# Altium schematic sheet MPU6050.SchDoc
size A4
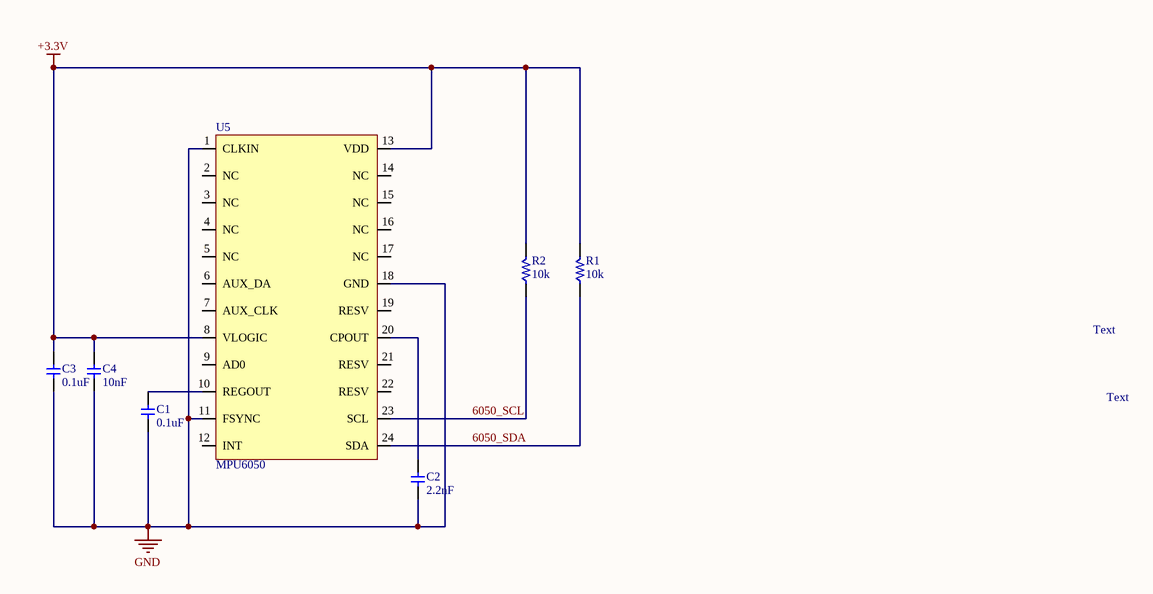
[diagram p0: MPU6050.SchDoc]

## Parts
C1  value 0.1uF  [0805]  (hidden comment: Generic Capacitor)
C2  value 2.2nF  [0805]  (hidden comment: Generic Capacitor)
C3  value 0.1uF  [0805]  (hidden comment: Generic Capacitor)
C4  value 10nF  [0805]  (hidden comment: Generic Capacitor)
R1  value 10k  [0805]  (hidden comment: Resistor)
R2  value 10k  [0805]  (hidden comment: Resistor)
U5  MPU6050  [MPU-6050]

## Nets
+3.3V: C3.1 C4.2 R1.2 R2.2 U5.8(VLOGIC) U5.13(VDD)
GND: C1.1 C2.1 C3.2 C4.1 U5.1(CLKIN) U5.11(FSYNC) U5.18(GND)
6050_SCL: R2.1 U5.23(SCL)
6050_SDA: R1.1 U5.24(SDA)
NetC1_2: C1.2 U5.10(REGOUT)
NetC2_2: C2.2 U5.20(CPOUT)

Not connected (* = marked no-connect by the designer): U5 2(NC) 3(NC) 4(NC) 5(NC) 6(AUX_DA) 7(AUX_CLK) 9(AD0) 12(INT) 14(NC) 15(NC) 16(NC) 17(NC) 19(RESV) 21(RESV) 22(RESV)

## Notes on the sheet
- Text

## Library data of the parts
C1-C4 = Capacitor
R1 R2 = Resistor: Generic Resistor
U5 = MPU6050: IMU ACCEL/GYRO 3-AXIS I2C 24QFN; Notes: *